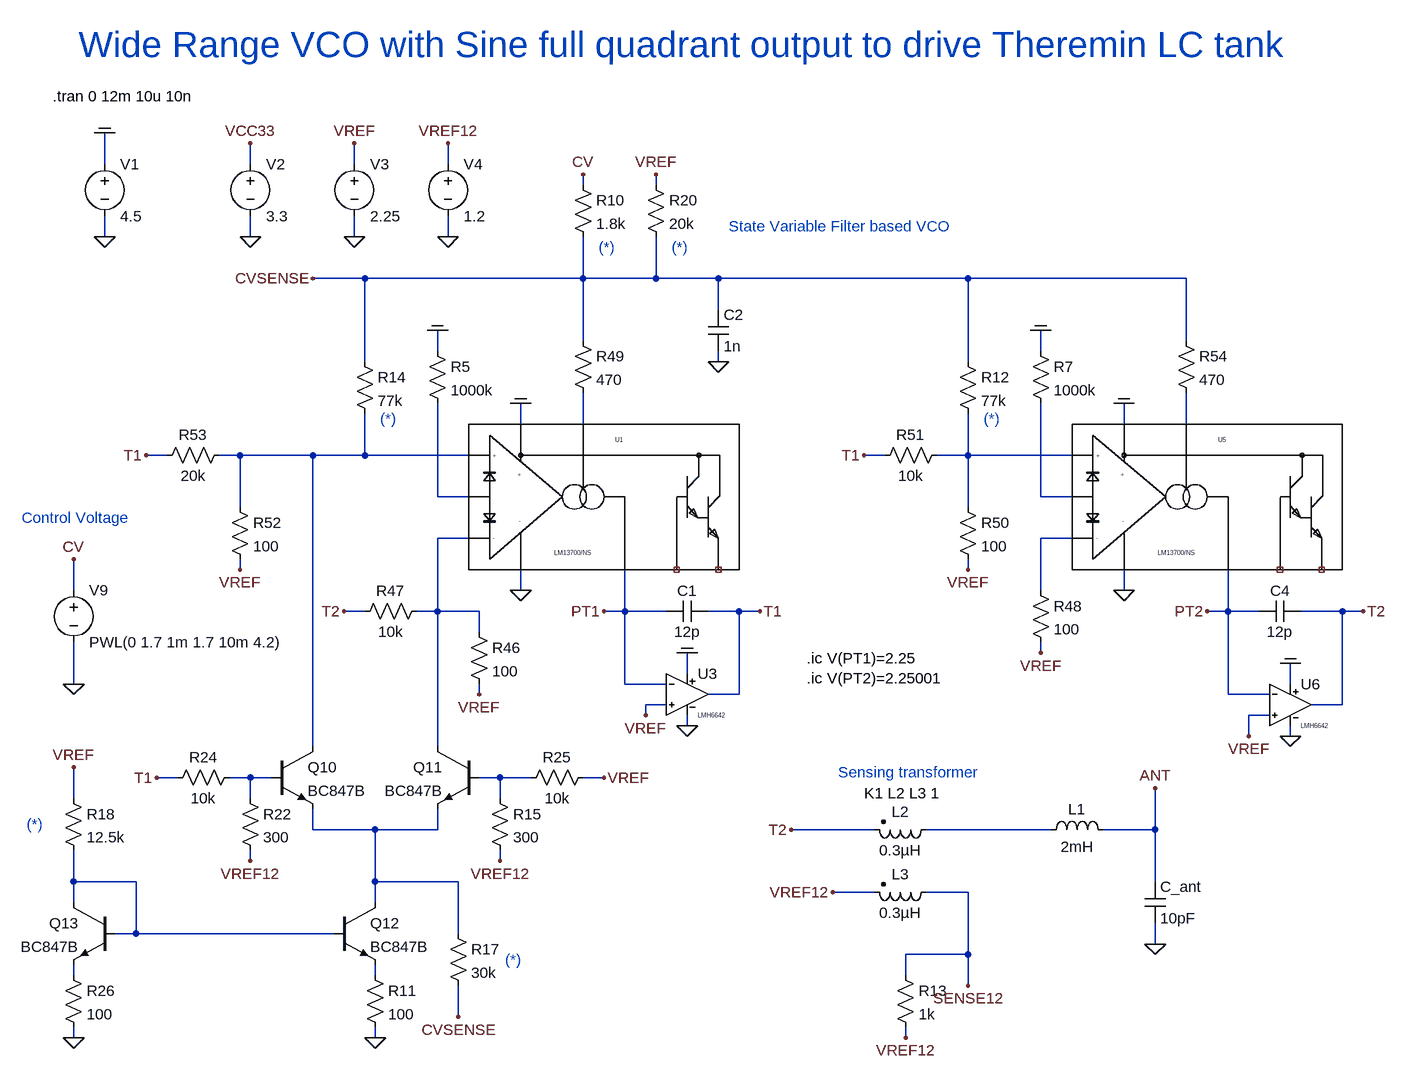
[diagram p0: schematic ota_svf_vco_v01.asc]
ota_svf_vco_v01.asc, the LTspice schematic file:
Version 4
SHEET 1 17540 12720
WIRE 4352 4176 4352 4128
WIRE 4576 4176 4576 4144
WIRE 4736 4176 4736 4144
WIRE 4880 4176 4880 4144
WIRE 5088 4208 5088 4192
WIRE 5200 4208 5200 4192
WIRE 4352 4288 4352 4256
WIRE 4576 4288 4576 4256
WIRE 4736 4288 4736 4256
WIRE 4880 4288 4880 4256
WIRE 4752 4352 4672 4352
WIRE 5088 4352 5088 4288
WIRE 5088 4352 4752 4352
WIRE 5200 4352 5200 4288
WIRE 5200 4352 5088 4352
WIRE 5296 4352 5200 4352
WIRE 5680 4352 5296 4352
WIRE 6016 4352 5680 4352
WIRE 5296 4400 5296 4352
WIRE 5088 4448 5088 4352
WIRE 6016 4448 6016 4352
WIRE 4864 4464 4864 4432
WIRE 5792 4464 5792 4432
WIRE 4752 4480 4752 4352
WIRE 5296 4480 5296 4464
WIRE 5680 4480 5680 4352
WIRE 4992 4576 4992 4544
WIRE 5088 4576 5088 4528
WIRE 5920 4576 5920 4544
WIRE 6016 4576 6016 4528
WIRE 4448 4624 4416 4624
WIRE 4560 4624 4528 4624
WIRE 4672 4624 4560 4624
WIRE 4752 4624 4752 4560
WIRE 4752 4624 4672 4624
WIRE 4912 4624 4752 4624
WIRE 5552 4624 5520 4624
WIRE 5680 4624 5680 4560
WIRE 5680 4624 5632 4624
WIRE 5840 4624 5680 4624
WIRE 4864 4688 4864 4544
WIRE 4912 4688 4864 4688
WIRE 5792 4688 5792 4544
WIRE 5840 4688 5792 4688
WIRE 4560 4704 4560 4624
WIRE 5680 4704 5680 4624
WIRE 4912 4752 4864 4752
WIRE 5840 4752 5792 4752
WIRE 4560 4800 4560 4784
WIRE 5680 4800 5680 4784
WIRE 4304 4832 4304 4784
WIRE 4992 4832 4992 4800
WIRE 5792 4832 5792 4752
WIRE 5920 4832 5920 4800
WIRE 4752 4864 4720 4864
WIRE 4864 4864 4864 4752
WIRE 4864 4864 4832 4864
WIRE 4928 4864 4864 4864
WIRE 5152 4864 5152 4800
WIRE 5152 4864 5120 4864
WIRE 5216 4864 5152 4864
WIRE 5328 4864 5280 4864
WIRE 5360 4864 5328 4864
WIRE 6080 4864 6080 4800
WIRE 6080 4864 6048 4864
WIRE 6128 4864 6080 4864
WIRE 6256 4864 6192 4864
WIRE 6288 4864 6256 4864
WIRE 4928 4896 4928 4864
WIRE 5792 4928 5792 4912
WIRE 5248 4960 5248 4928
WIRE 4304 4976 4304 4912
WIRE 5152 4976 5152 4864
WIRE 5216 4976 5152 4976
WIRE 6176 4976 6176 4944
WIRE 4928 4992 4928 4976
WIRE 5328 4992 5328 4864
WIRE 5328 4992 5280 4992
WIRE 6080 4992 6080 4864
WIRE 6144 4992 6080 4992
WIRE 5216 5008 5184 5008
WIRE 6256 5008 6256 4864
WIRE 6256 5008 6208 5008
WIRE 5184 5024 5184 5008
WIRE 6144 5024 6112 5024
WIRE 5248 5040 5248 5024
WIRE 6112 5056 6112 5024
WIRE 6176 5056 6176 5040
WIRE 4672 5072 4672 4624
WIRE 4864 5072 4864 4864
WIRE 4464 5120 4432 5120
WIRE 4576 5120 4544 5120
WIRE 4608 5120 4576 5120
WIRE 4960 5120 4928 5120
WIRE 5008 5120 4960 5120
WIRE 5120 5120 5088 5120
WIRE 4304 5152 4304 5104
WIRE 4576 5152 4576 5120
WIRE 4960 5152 4960 5120
WIRE 4672 5200 4672 5168
WIRE 4768 5200 4672 5200
WIRE 4864 5200 4864 5168
WIRE 4864 5200 4768 5200
WIRE 5536 5200 5408 5200
WIRE 5808 5200 5616 5200
WIRE 5968 5200 5968 5136
WIRE 5968 5200 5888 5200
WIRE 4576 5248 4576 5232
WIRE 4960 5248 4960 5232
WIRE 4304 5280 4304 5232
WIRE 4400 5280 4304 5280
WIRE 4768 5280 4768 5200
WIRE 4896 5280 4768 5280
WIRE 5968 5280 5968 5200
WIRE 5536 5296 5472 5296
WIRE 5680 5296 5616 5296
WIRE 4304 5312 4304 5280
WIRE 4768 5312 4768 5280
WIRE 4400 5360 4400 5280
WIRE 4400 5360 4368 5360
WIRE 4704 5360 4400 5360
WIRE 4896 5360 4896 5280
WIRE 5968 5376 5968 5344
WIRE 5680 5392 5680 5296
WIRE 5680 5392 5584 5392
WIRE 4304 5424 4304 5408
WIRE 4768 5424 4768 5408
WIRE 5584 5424 5584 5392
WIRE 5680 5440 5680 5392
WIRE 4896 5488 4896 5440
WIRE 4304 5520 4304 5504
WIRE 4768 5520 4768 5504
WIRE 5584 5520 5584 5504
FLAG 4352 4288 0
FLAG 4352 4128 COM
FLAG 4576 4288 0
FLAG 4576 4144 VCC33
FLAG 4736 4288 0
FLAG 4736 4144 VREF
FLAG 5968 5136 ANT
FLAG 5968 5376 0
FLAG 5408 5200 T2
FLAG 5472 5296 VREF12
FLAG 5680 5440 SENSE12
FLAG 5584 5520 VREF12
FLAG 4992 4832 0
FLAG 4992 4544 COM
FLAG 5248 5040 0
FLAG 5248 4928 COM
FLAG 5184 5024 VREF
FLAG 5360 4864 T1
FLAG 5120 4864 PT1
FLAG 5920 4832 0
FLAG 5920 4544 COM
FLAG 6176 5056 0
FLAG 6176 4944 COM
FLAG 6112 5056 VREF
FLAG 6288 4864 T2
FLAG 6048 4864 PT2
FLAG 4928 4992 VREF
FLAG 4720 4864 T2
FLAG 5792 4928 VREF
FLAG 5680 4800 VREF
FLAG 5520 4624 T1
FLAG 4560 4800 VREF
FLAG 4416 4624 T1
FLAG 4864 4432 COM
FLAG 5792 4432 COM
FLAG 4768 5520 0
FLAG 4960 5248 VREF12
FLAG 4304 5520 0
FLAG 5120 5120 VREF
FLAG 4304 4976 0
FLAG 4304 4784 CV
FLAG 5088 4192 CV
FLAG 5200 4192 VREF
FLAG 4672 4352 CVSENSE
FLAG 4576 5248 VREF12
FLAG 4432 5120 T1
FLAG 4896 5488 CVSENSE
FLAG 5296 4480 0
FLAG 4304 5104 VREF
FLAG 4880 4288 0
FLAG 4880 4144 VREF12
SYMBOL voltage 4352 4160 R0
SYMATTR InstName V1
SYMATTR Value 4.5
SYMBOL voltage 4576 4160 R0
SYMATTR InstName V2
SYMATTR Value 3.3
SYMBOL voltage 4736 4160 R0
SYMATTR InstName V3
SYMATTR Value 2.25
SYMBOL ind 5792 5216 R270
WINDOW 0 32 56 VTop 2
WINDOW 3 5 56 VBottom 2
SYMATTR InstName L1
SYMATTR Value 2mH
SYMATTR SpiceLine Rser=120 Cpar=1pF
SYMBOL Cap 5952 5280 R0
SYMATTR InstName C_ant
SYMATTR Value 10pF
SYMBOL ind2 5632 5184 R90
WINDOW 0 4 56 VBottom 2
WINDOW 3 32 56 VTop 2
SYMATTR InstName L2
SYMATTR Value 0.3µH
SYMATTR SpiceLine Rser=0.1 Cpar=0.1p
SYMBOL ind2 5632 5280 R90
WINDOW 0 4 56 VBottom 2
WINDOW 3 32 56 VTop 2
SYMATTR InstName L3
SYMATTR Value 0.3µH
SYMATTR SpiceLine Rser=0.1 Cpar=0.1p
SYMBOL Res 5568 5408 R0
SYMATTR InstName R13
SYMATTR Value 1k
SYMBOL LM13700 4992 4688 R0
SYMATTR InstName U1
SYMBOL Cap 5280 4848 R90
WINDOW 0 0 32 VBottom 2
WINDOW 3 32 32 VTop 2
SYMATTR InstName C1
SYMATTR Value 12p
SYMBOL LMH6642 5248 4928 R0
WINDOW 0 16 32 Left 2
SYMATTR InstName U3
SYMBOL LM13700 5920 4688 R0
SYMATTR InstName U5
SYMBOL Cap 6192 4848 R90
WINDOW 0 0 32 VBottom 2
WINDOW 3 32 32 VTop 2
SYMATTR InstName C4
SYMATTR Value 12p
SYMBOL LMH6642 6176 4944 R0
WINDOW 0 16 32 Left 2
SYMATTR InstName U6
SYMBOL Res 4912 4880 R0
SYMATTR InstName R46
SYMATTR Value 100
SYMBOL Res 4848 4848 R90
WINDOW 0 0 56 VBottom 2
WINDOW 3 32 56 VTop 2
SYMATTR InstName R47
SYMATTR Value 10k
SYMBOL Res 5776 4816 R0
SYMATTR InstName R48
SYMATTR Value 100
SYMBOL Res 5664 4688 R0
SYMATTR InstName R50
SYMATTR Value 100
SYMBOL Res 5648 4608 R90
WINDOW 0 0 56 VBottom 2
WINDOW 3 32 56 VTop 2
SYMATTR InstName R51
SYMATTR Value 10k
SYMBOL Res 4544 4688 R0
SYMATTR InstName R52
SYMATTR Value 100
SYMBOL Res 4544 4608 R90
WINDOW 0 0 56 VBottom 2
WINDOW 3 32 56 VTop 2
SYMATTR InstName R53
SYMATTR Value 20k
SYMBOL Res 5072 4432 R0
SYMATTR InstName R49
SYMATTR Value 470
SYMBOL Res 6000 4432 R0
SYMATTR InstName R54
SYMATTR Value 470
SYMBOL Res 4848 4448 R0
SYMATTR InstName R5
SYMATTR Value 1000k
SYMBOL Res 5776 4448 R0
SYMATTR InstName R7
SYMATTR Value 1000k
SYMBOL npn 4608 5072 R0
SYMATTR InstName Q10
SYMATTR Value BC847B
SYMBOL npn 4928 5072 M0
SYMATTR InstName Q11
SYMATTR Value BC847B
SYMBOL Res 4752 5408 R0
SYMATTR InstName R11
SYMATTR Value 100
SYMBOL npn 4704 5312 R0
SYMATTR InstName Q12
SYMATTR Value BC847B
SYMBOL Res 4944 5136 R0
SYMATTR InstName R15
SYMATTR Value 300
SYMBOL Res 5104 5104 R90
WINDOW 0 0 56 VBottom 2
WINDOW 3 32 56 VTop 2
SYMATTR InstName R25
SYMATTR Value 10k
SYMBOL Res 4288 5408 R0
SYMATTR InstName R26
SYMATTR Value 100
SYMBOL npn 4368 5312 M0
SYMATTR InstName Q13
SYMATTR Value BC847B
SYMBOL Voltage 4304 4816 R0
SYMATTR InstName V9
SYMATTR Value PWL(0 1.7 1m 1.7 10m 4.2)
SYMBOL Res 5072 4192 R0
SYMATTR InstName R10
SYMATTR Value 1.8k
SYMBOL Res 5184 4192 R0
SYMATTR InstName R20
SYMATTR Value 20k
SYMBOL Res 4560 5136 R0
SYMATTR InstName R22
SYMATTR Value 300
SYMBOL Res 4560 5104 R90
WINDOW 0 0 56 VBottom 2
WINDOW 3 32 56 VTop 2
SYMATTR InstName R24
SYMATTR Value 10k
SYMBOL Res 5664 4464 R0
SYMATTR InstName R12
SYMATTR Value 77k
SYMBOL Res 4736 4464 R0
SYMATTR InstName R14
SYMATTR Value 77k
SYMBOL Res 4880 5344 R0
SYMATTR InstName R17
SYMATTR Value 30k
SYMBOL Cap 5280 4400 R0
SYMATTR InstName C2
SYMATTR Value 1n
SYMBOL Res 4288 5136 R0
SYMATTR InstName R18
SYMATTR Value 12.5k
SYMBOL voltage 4880 4160 R0
SYMATTR InstName V4
SYMATTR Value 1.2
TEXT 4272 4072 Left 2 !.tran 0 12m 10u 10n
TEXT 4312 3992 Left 5 ;Wide Range VCO with Sine full quadrant output to drive Theremin LC tank
TEXT 5520 5144 Left 2 !K1 L2 L3 1
TEXT 5480 5112 Left 2 ;Sensing transformer
TEXT 5312 4272 Left 2 ;State Variable Filter based VCO
TEXT 5432 4936 Left 2 !.ic V(PT1)=2.25\n.ic V(PT2)=2.25001
TEXT 4224 4720 Left 2 ;Control Voltage
TEXT 4776 4568 Left 2 ;(*)
TEXT 5704 4568 Left 2 ;(*)
TEXT 4968 5400 Left 2 ;(*)
TEXT 4232 5192 Left 2 ;(*)
TEXT 5112 4304 Left 2 ;(*)
TEXT 5224 4304 Left 2 ;(*)

The netlist it stands for:
* ota_svf_vco_v01.asc
V1 COM 0 4.5
V2 VCC33 0 3.3
V3 VREF 0 2.25
L1 N012 ANT 2mH Rser=120 Cpar=1pF
C_ant ANT 0 10pF
L2 N012 T2 0.3µH Rser=0.1 Cpar=0.1p
L3 SENSE12 VREF12 0.3µH Rser=0.1 Cpar=0.1p
R13 SENSE12 VREF12 1k
XU1 N001 N005 N003 N007 PT1 0 NC_01 NC_02 COM LM13700/NS  ; pins Ibias Dio_bias in+ in- out V- buf_in buf_out V+
C1 T1 PT1 12p
XU3 PT1 VREF COM 0 T1 LMH6642  ; pins In- In+ V+ V- OUT
XU5 N002 N006 N004 N008 PT2 0 NC_03 NC_04 COM LM13700/NS  ; pins Ibias Dio_bias in+ in- out V- buf_in buf_out V+
C4 T2 PT2 12p
XU6 PT2 VREF COM 0 T2 LMH6642  ; pins In- In+ V+ V- OUT
R46 N007 VREF 100
R47 N007 T2 10k
R48 N008 VREF 100
R50 N004 VREF 100
R51 N004 T1 10k
R52 N003 VREF 100
R53 N003 T1 20k
R49 CVSENSE N001 470
R54 CVSENSE N002 470
R5 COM N005 1000k
R7 COM N006 1000k
Q10 N003 N009 N011 0 BC847B
Q11 N007 N010 N011 0 BC847B
R11 N015 0 100
Q12 N011 N013 N015 0 BC847B
R15 N010 VREF12 300
R25 VREF N010 10k
R26 N014 0 100
Q13 N013 N013 N014 0 BC847B
V9 CV 0 PWL(0 1.7 1m 1.7 10m 4.2)
R10 CV CVSENSE 1.8k
R20 VREF CVSENSE 20k
R22 N009 VREF12 300
R24 N009 T1 10k
R12 CVSENSE N004 77k
R14 CVSENSE N003 77k
R17 N011 CVSENSE 30k
C2 CVSENSE 0 1n
R18 VREF N013 12.5k
V4 VREF12 0 1.2
.model NPN NPN
.model PNP PNP
.lib standard.bjt
.tran 0 12m 10u 10n
* Wide Range VCO with Sine full quadrant output to drive Theremin LC tank
K1 L2 L3 1
* Sensing transformer
* State Variable Filter based VCO
.ic V(PT1)=2.25
.ic V(PT2)=2.25001
* Control Voltage
* (*)
* (*)
* (*)
* (*)
* (*)
* (*)
.lib ns_models.lib
.lib LMH6642.MOD
.backanno
.end